# EAGLE schematic IMU (EAGLE 8.1.0)
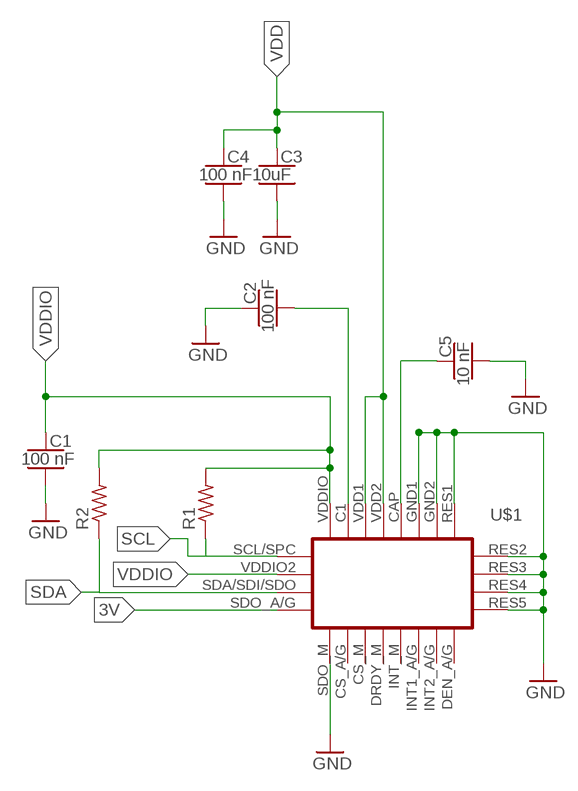
[diagram p0: schematic, sheet 1]

## Parts
C1  100 nF  CAPACITOR-NP_SMD-2012-0805_CERAMIC  [CAPC2012X140_HS]
C2  100 nF  CAPACITOR-NP_SMD-2012-0805_CERAMIC  [CAPC2012X140_HS]
C3  10uF  CAPACITOR-NP_SMD-2012-0805_CERAMIC-10UF  [CAPC2012X140_HS]
C4  100 nF  CAPACITOR-NP_SMD-2012-0805_CERAMIC  [CAPC2012X140_HS]
C5  10 nF  CAPACITOR-NP_SMD-2012-0805_CERAMIC  [CAPC2012X140_HS]
R1  RESISTOR_SMD-2012-0805  [RESC2012X60_HS]
R2  RESISTOR_SMD-2012-0805  [RESC2012X60_HS]
U$1  IMU_9AXIS  [IMU_9AXIS]

## Nets
3V: U$1.SDO_A/G
GND: C1.2 C2.1 C3.2 C4.2 C5.2 U$1.GND1 U$1.GND2 U$1.RES1 U$1.RES2 U$1.RES3 U$1.RES4 U$1.RES5 U$1.SDO_M
N$20: C5.1 U$1.CAP
N$23: C2.2 U$1.C1
SCL: R1.1 U$1.SCL/SPC
SDA: R2.1 U$1.SDA/SDI/SDO
VDD: C3.1 C4.1 U$1.VDD1 U$1.VDD2
VDDIO: C1.1 R1.2 R2.2 U$1.VDDIO2 U$1.VDDIO(VDDIO1)
Unconnected: U$1.CS_A/G U$1.CS_M U$1.DEN_A/G U$1.DRDY_M U$1.INT1_A/G U$1.INT2_A/G U$1.INT_M

## Library data of the parts
C1 C2 C4 C5 = quadparts_prebuilt:CAPACITOR-NP_: Nonpolarized capacitor
C3 = quadparts_prebuilt:CAPACITOR-NP_: Nonpolarized capacitor; DIST: Digikey; DISTPN: 490-5523-1-ND; MFR: Murata Electronics North America; MPN: GRM21BR61E106KA73L
R1 R2 = quadparts_prebuilt:RESISTOR_: Resistor
U$1 = quadparts:IMU_9AXIS; CREATOR: Alexander Orr; DIST: Digikey; DISTPN: 497-14946-1-ND; MFR: STMicroelectronics; MPN: LSM9DS1TR